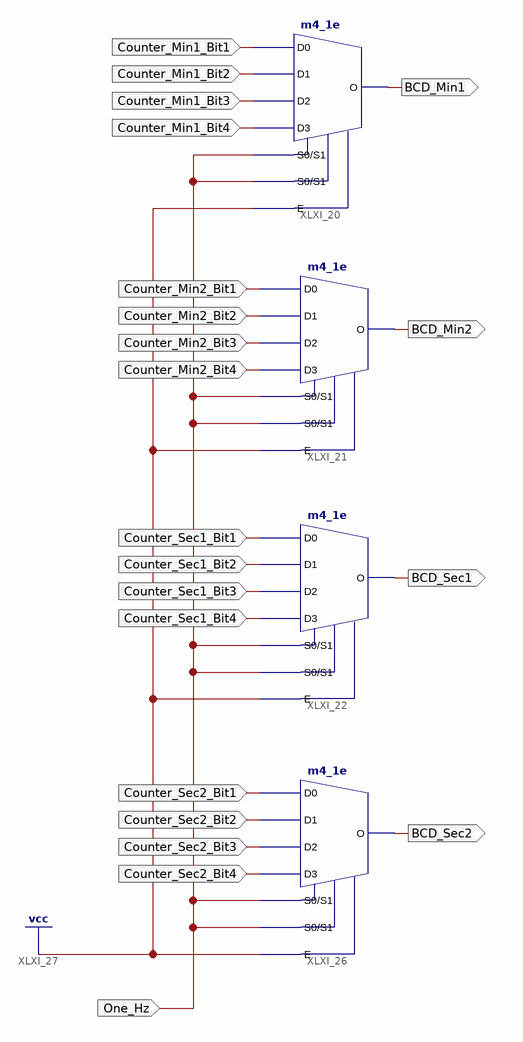
[diagram p0: schematic sheet 1]
// Xilinx ISE schematic Multiplexer_BCD.sch (spartan6) as structural Verilog: 4 symbols, 21 ports
module Multiplexer_BCD (
  input  One_Hz,
  input  Counter_Min1_Bit1,
  input  Counter_Min1_Bit2,
  input  Counter_Min1_Bit3,
  input  Counter_Min1_Bit4,
  input  Counter_Min2_Bit1,
  input  Counter_Min2_Bit2,
  input  Counter_Min2_Bit3,
  input  Counter_Min2_Bit4,
  input  Counter_Sec1_Bit1,
  input  Counter_Sec1_Bit2,
  input  Counter_Sec1_Bit3,
  input  Counter_Sec1_Bit4,
  input  Counter_Sec2_Bit1,
  input  Counter_Sec2_Bit2,
  input  Counter_Sec2_Bit3,
  input  Counter_Sec2_Bit4,
  output BCD_Min1,
  output BCD_Min2,
  output BCD_Sec1,
  output BCD_Sec2
);

  m4_1e XLXI_20 (
    .D0(Counter_Min1_Bit1), .D1(Counter_Min1_Bit2), .D2(Counter_Min1_Bit3), .D3(Counter_Min1_Bit4), .E(1'b1),
    .S0(One_Hz), .S1(One_Hz), .O(BCD_Min1));
  m4_1e XLXI_21 (
    .D0(Counter_Min2_Bit1), .D1(Counter_Min2_Bit2), .D2(Counter_Min2_Bit3), .D3(Counter_Min2_Bit4), .E(1'b1),
    .S0(One_Hz), .S1(One_Hz), .O(BCD_Min2));
  m4_1e XLXI_22 (
    .D0(Counter_Sec1_Bit1), .D1(Counter_Sec1_Bit2), .D2(Counter_Sec1_Bit3), .D3(Counter_Sec1_Bit4), .E(1'b1),
    .S0(One_Hz), .S1(One_Hz), .O(BCD_Sec1));
  m4_1e XLXI_26 (
    .D0(Counter_Sec2_Bit1), .D1(Counter_Sec2_Bit2), .D2(Counter_Sec2_Bit3), .D3(Counter_Sec2_Bit4), .E(1'b1),
    .S0(One_Hz), .S1(One_Hz), .O(BCD_Sec2));
endmodule
